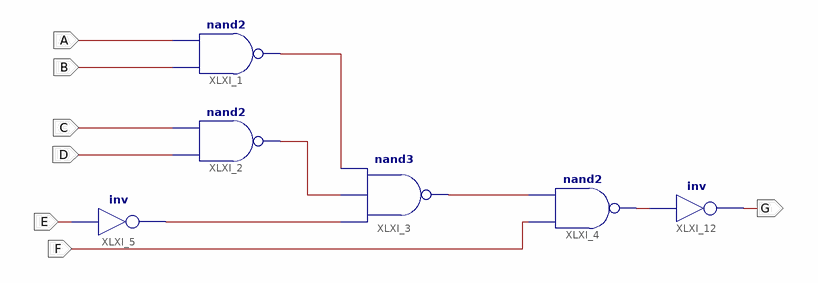
[diagram p0: schematic sheet 1]
// Xilinx ISE schematic C3_16.sch (kintex7) as structural Verilog: 6 symbols, 7 ports
module C3_16 (
  input  F,
  input  D,
  input  C,
  input  B,
  input  A,
  input  E,
  output G
);

  wire XLXN_1, XLXN_2, XLXN_3, XLXN_4, XLXN_12;

  nand XLXI_1 (XLXN_1, B, A);
  nand XLXI_2 (XLXN_2, D, C);
  nand XLXI_3 (XLXN_4, XLXN_3, XLXN_2, XLXN_1);
  nand XLXI_4 (XLXN_12, F, XLXN_4);
  not XLXI_5 (XLXN_3, E);
  not XLXI_12 (G, XLXN_12);
endmodule
